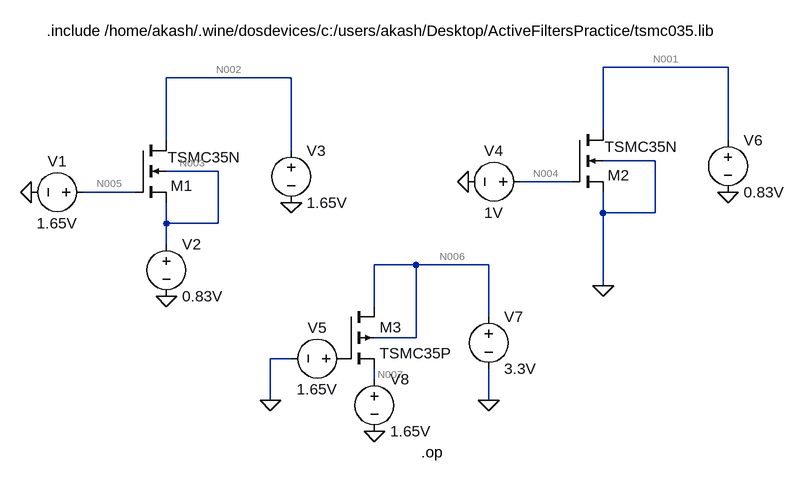
[diagram p0: schematic Transconductor_Bias_Width_Calculation.asc]
Transconductor_Bias_Width_Calculation.asc, the LTspice schematic file:
Version 4
SHEET 1 880 688
WIRE 736 80 544 80
WIRE 64 96 -128 96
WIRE 544 176 544 80
WIRE -128 192 -128 96
WIRE 736 192 736 80
WIRE 64 208 64 96
WIRE 624 224 544 224
WIRE -48 240 -128 240
WIRE 496 256 416 256
WIRE -176 272 -256 272
WIRE 544 304 544 272
WIRE 624 304 624 224
WIRE 624 304 544 304
WIRE -128 320 -128 288
WIRE -48 320 -48 240
WIRE -48 320 -128 320
WIRE -128 352 -128 320
WIRE 256 384 192 384
WIRE 368 384 256 384
WIRE 544 416 544 304
WIRE 192 448 192 384
WIRE 368 464 368 384
WIRE 256 496 256 384
WIRE 256 496 192 496
WIRE 64 528 32 528
WIRE 192 560 192 544
WIRE 32 592 32 528
WIRE 368 592 368 544
FLAG -336 272 0
FLAG -128 432 0
FLAG 64 288 0
FLAG 336 256 0
FLAG 544 416 0
FLAG 736 272 0
FLAG 368 592 0
FLAG 32 592 0
FLAG 192 640 0
SYMBOL nmos4 -176 192 R0
WINDOW 0 55 70 Left 2
WINDOW 3 50 26 Left 2
SYMATTR InstName M1
SYMATTR Value TSMC35N
SYMATTR Value2 l=0.5u w=55u m=2
SYMBOL voltage -240 272 R90
WINDOW 0 -32 56 VBottom 2
WINDOW 3 32 56 VTop 2
WINDOW 123 0 0 Left 0
WINDOW 39 0 0 Left 0
SYMATTR InstName V1
SYMATTR Value 1.65V
SYMBOL voltage -128 336 R0
WINDOW 123 0 0 Left 0
WINDOW 39 0 0 Left 0
SYMATTR InstName V2
SYMATTR Value 0.83V
SYMBOL voltage 64 192 R0
WINDOW 123 0 0 Left 0
WINDOW 39 0 0 Left 0
SYMATTR InstName V3
SYMATTR Value 1.65V
SYMBOL nmos4 496 176 R0
WINDOW 0 55 70 Left 2
WINDOW 3 50 26 Left 2
SYMATTR InstName M2
SYMATTR Value TSMC35N
SYMATTR Value2 l=0.5u w=12u m=2
SYMBOL voltage 432 256 R90
WINDOW 0 -32 56 VBottom 2
WINDOW 3 32 56 VTop 2
WINDOW 123 0 0 Left 0
WINDOW 39 0 0 Left 0
SYMATTR InstName V4
SYMATTR Value 1V
SYMBOL voltage 736 176 R0
WINDOW 123 0 0 Left 0
WINDOW 39 0 0 Left 0
SYMATTR InstName V6
SYMATTR Value 0.83V
SYMBOL pmos4 144 448 R0
SYMATTR InstName M3
SYMATTR Value TSMC35P
SYMATTR Value2 l=0.5u w=2u m=2
SYMBOL voltage 160 528 R90
WINDOW 0 -32 56 VBottom 2
WINDOW 3 32 56 VTop 2
WINDOW 123 0 0 Left 0
WINDOW 39 0 0 Left 0
SYMATTR InstName V5
SYMATTR Value 1.65V
SYMBOL voltage 368 448 R0
WINDOW 123 0 0 Left 0
WINDOW 39 0 0 Left 0
SYMATTR InstName V7
SYMATTR Value 3.3V
SYMBOL voltage 192 544 R0
SYMATTR InstName V8
SYMATTR Value 1.65V
TEXT -312 24 Left 2 !.include /home/akash/.wine/dosdevices/c:/users/akash/Desktop/ActiveFiltersPractice/tsmc035.lib
TEXT 264 672 Left 2 !.op

The netlist it stands for:
* Transconductor_Bias_Width_Calculation.asc
M1 N002 N005 N003 N003 TSMC35N l=0.5u w=55u m=2
V1 N005 0 1.65V
V2 N003 0 0.83V
V3 N002 0 1.65V
M2 N001 N004 0 0 TSMC35N l=0.5u w=12u m=2
V4 N004 0 1V
V6 N001 0 0.83V
M3 N006 P001 N007 N006 TSMC35P l=0.5u w=2u m=2
V5 P001 0 1.65V
V7 N006 0 3.3V
V8 N007 0 1.65V
.model NMOS NMOS
.model PMOS PMOS
.lib standard.mos
.include /home/akash/.wine/dosdevices/c:/users/akash/Desktop/ActiveFiltersPractice/tsmc035.lib
.op
.backanno
.end

* Results of the author's LTspice run, read from the files saved beside the schematic
* Operating Point:
*   V(n002) = 1.65 V
*   V(n005) = 1.65 V
*   V(n003) = 830 mV
*   V(n001) = 830 mV
*   V(n004) = 1 V
*   V(n006) = 3.3 V
*   V(p001) = 1.65 V
*   V(n007) = 1.65 V
*   Id(M3) = 104.1 µA
*   Ig(M3) = 0 A
*   Ib(M3) = 3.32 pA
*   Is(M3) = -104.1 µA
*   Id(M2) = 204.7 µA
*   Ig(M2) = 0 A
*   Ib(M2) = -1.68 pA
*   Is(M2) = -204.7 µA
*   Id(M1) = 101.7 µA
*   Ig(M1) = 0 A
*   Ib(M1) = -1.66 pA
*   Is(M1) = -101.7 µA
*   I(V8) = 104.1 µA
*   I(V7) = -104.1 µA
*   I(V5) = 0 A
*   I(V6) = -204.7 µA
*   I(V4) = 0 A
*   I(V3) = -101.7 µA
*   I(V2) = 101.7 µA
*   I(V1) = 0 A
* From the log:
*   Semiconductor Device Operating Points:
*                           --- BSIM3 MOSFETS ---
*   Name:        m3          m2          m1
*   Model:     tsmc35p     tsmc35n     tsmc35n
*   Id:        1.04e-04    2.05e-04    1.02e-04
*   Vgs:       0.00e+00    1.00e+00    8.20e-01
*   Vds:       1.65e+00    8.30e-01    8.20e-01
*   Vbs:       1.65e+00    0.00e+00    0.00e+00
*   Vth:      -8.05e-01    7.53e-01    7.51e-01
*   Vdsat:    -6.45e-01    1.86e-01    7.80e-02
*   Gm:        2.03e-04    1.77e-03    1.68e-03
*   Gds:       6.19e-06    3.19e-05    2.55e-05
*   Gmb        3.73e-05    4.39e-04    4.41e-04
*   Cbd:       0.00e+00    0.00e+00    0.00e+00
*   Cbs:       0.00e+00    0.00e+00    0.00e+00
*   Cgsov:     7.31e-16    6.53e-15    3.05e-14
*   Cgdov:     7.31e-16    6.53e-15    3.05e-14
*   Cgbov:     1.00e-16    9.06e-17    9.06e-17
*   dQgdVgb:   7.66e-15    5.10e-14    2.14e-13
*   dQgdVdb:  -6.71e-16   -6.32e-15   -2.97e-14
*   dQgdVsb:  -6.63e-15   -4.07e-14   -1.58e-13
*   dQddVgb:  -3.24e-15   -2.19e-14   -8.84e-14
*   dQddVdb:   6.99e-16    6.41e-15    3.00e-14
*   dQddVsb:   3.09e-15    2.01e-14    7.59e-14
*   dQbdVgb:  -1.17e-15   -7.16e-15   -3.73e-14
*   dQbdVdb:   4.04e-18    3.37e-17    1.51e-16
*   dQbdVsb:  -2.74e-16   -5.93e-15   -2.40e-14